# Altium schematic sheet Sensor.SchDoc
size A4
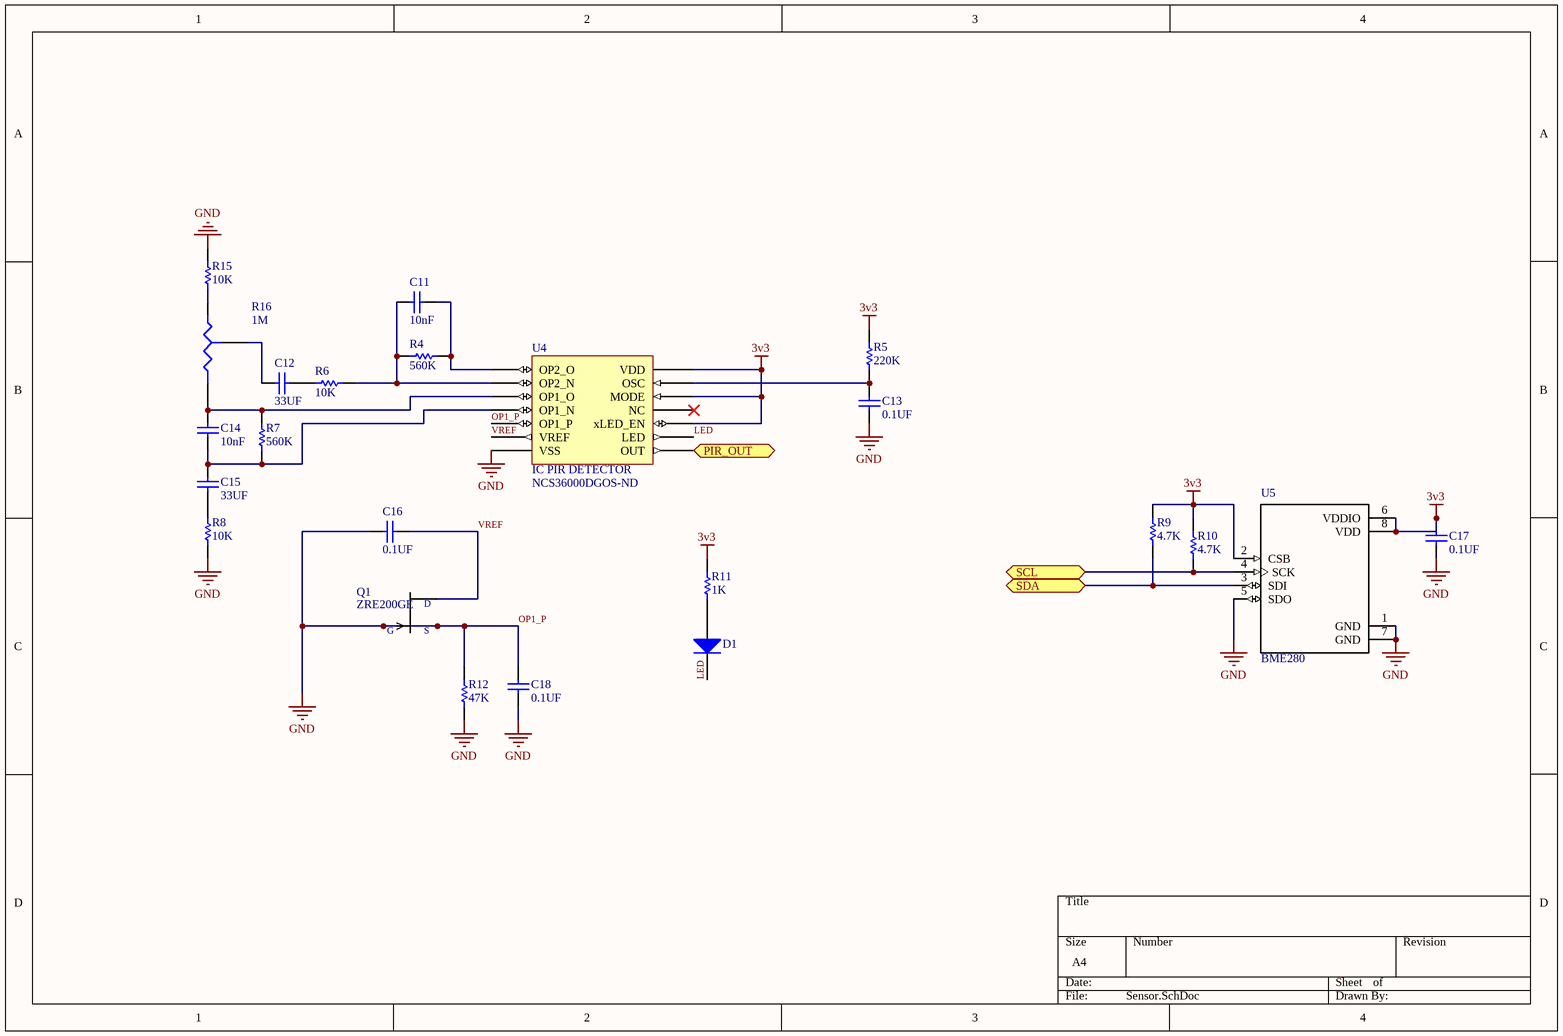
[diagram p0: Sensor.SchDoc]

## Parts
C11  10nF  [Chip2PinSM127P600-8N-SAMSUNG-0603]
C12  33UF  [Chip2PinSM127P600-8N-TDK_0603]
C13  0.1UF  [Chip2PinSM127P600-8N-SAMSUNG-0603]
C14  10nF  [Chip2PinSM127P600-8N-SAMSUNG-0603]
C15  33UF  [Chip2PinSM127P600-8N-TDK_0603]
C16  0.1UF  [Chip2PinSM127P600-8N-SAMSUNG-0603]
C17  0.1UF  [Chip2PinSM127P600-8N-SAMSUNG-0603]
C18  0.1UF  [Chip2PinSM127P600-8N-SAMSUNG-0603]
D1  SML-D12M8WT86  [LED_0603_ROHM]  (value not drawn)
Q1  ZRE200GE  [TO5]
R4  560K  [Chip2PinSM127P600-8N-Stackpole-0603]
R5  220K  [Chip2PinSM127P600-8N-vishay-0603]
R6  10K  [Chip2PinSM127P600-8N-vishay-0603]
R7  560K  [Chip2PinSM127P600-8N-Stackpole-0603]
R8  10K  [Chip2PinSM127P600-8N-vishay-0603]
R9  4.7K  [Chip2PinSM127P600-8N-vishay-0603]
R10  4.7K  [Chip2PinSM127P600-8N-vishay-0603]
R11  1K  [Chip2PinSM127P600-8N-vishay-0603]
R12  47K  [Chip2PinSM127P600-8N-0603-te]
R15  10K  [Chip2PinSM127P600-8N-vishay-0603]
R16  value 1M  [PCBComponent_1 - duplicate1]
U4  IC PIR DETECTOR  Supplier Part Number 1: NCS36000DGOS-ND  [SOIC127P600-8N-PIRIC_NCS36000]
U5  BME280  [PSON65P250X250X100-8N]

## Ports
PIR_OUT (out), SCL (bidir), SDA (bidir)

## Nets
3v3: C17.2 R5.2 R9.2 R10.2 R11.2 U4.10(xLED_EN) U4.12(MODE) U4.14(VDD) U5.2(CSB) U5.6(VDDIO) U5.8(VDD)
GND: C13.2 C16.1 C17.1 C18.2 Q1.3(G) R8.2 R12.1 R15.1 U4.7(VSS) U5.1(GND) U5.5(SDO) U5.7(GND)
LED: D1.2(K) U4.9(LED)
OP1_P: C18.1 Q1.2(S) R12.2 U4.5(OP1_P)
PIR_OUT: U4.8(OUT) ; port PIR_OUT
SCL: R10.1 U5.4(SCK) ; port SCL
SDA: R9.1 U5.3(SDI) ; port SDA
VREF: C16.2 Q1.1(D) U4.6(VREF)
NetC11_1: C11.1 R4.1 R6.2 U4.2(OP2_N)
NetC11_2: C11.2 R4.2 U4.1(OP2_O)
NetC12_1: C12.1 R16.3(TAP)
NetC12_2: C12.2 R6.1
NetC13_1: C13.1 R5.1 U4.13(OSC)
NetC14_1: C14.1 R7.2 R16.2(B) U4.3(OP1_O)
NetC14_2: C14.2 C15.2 R7.1 U4.4(OP1_N)
NetC15_1: C15.1 R8.1
NetD1_1: D1.1(A) R11.1
NetR15_2: R15.2 R16.1(A)

Not connected (* = marked no-connect by the designer): U4 11(NC)*

## Library data of the parts
C11 C14 = CL10B103KB8NCNC: CAP CER 10000PF 50V X7R 0603; Manufacturer: Samsung Electro-Mechanics; Tolerance: ±10%; Supplier 1: Digi-Key; Manufacturer Part Number: CL10B103KB8NCNC; RoHS: RoHS Compliant; Category: Capacitors; Stock 1: 1066876; Pricing 1: 1=0.09, 10=0.029, 100=0.0129, 500=0.00926, 1000=0.00728 (EUR); Packaging: Cut Tape (CT); Part Status: Active; Voltage - Rated: 50V; Temperature Coefficient: X7R; Operating Temperature: -55°C ~ 125°C; Features: -; Ratings: -; Applications: General Purpose; Mounting Type: Surface Mount, MLCC; Package / Case: 0603 (1608 Metric); Size / Dimension: 0.063" L x 0.031" W (1.60mm x 0.80mm); Height - Seated (Max): -; Thickness (Max): 0.035" (0.90mm); Lead Spacing: -; Lead Style: -; ComponentLink1URL: http://www.samsungsem.com/kr/support/product-search/mlcc/CL10B103KB8NCNC.jsp; ComponentLink1Description: http://www.samsungsem.com/kr/support/product-search/mlcc/CL10B103KB8NCNC.jsp; Supplier Part Number 1: 1276-1921-1-ND
C12 C15 = C2012X5R0J336M125AC: CAP CER 33UF 6.3V X5R 0805; Manufacturer: TDK Corporation; Tolerance: ±20%; Notification: Current market demand for these product types have resulted in fluctuating and extending lead times. Lead times may differ.; Supplier 1: Digi-Key; Manufacturer Part Number: C2012X5R0J336M125AC; RoHS: RoHS Compliant; Category: Capacitors; Stock 1: 20000; Pricing 1: 1=0.86, 10=0.654, 100=0.4676, 500=0.362, 1000=0.31172 (EUR); Packaging: Digi-Reel®; Part Status: Active; Voltage - Rated: 6.3V; Temperature Coefficient: X5R; Operating Temperature: -55°C ~ 85°C; Features: Low ESL; Ratings: -; Applications: General Purpose; Failure Rate: -; Mounting Type: Surface Mount, MLCC; Package / Case: 0805 (2012 Metric); Size / Dimension: 0.079" L x 0.049" W (2.00mm x 1.25mm); Height - Seated (Max): -; Thickness (Max): 0.057" (1.45mm); Lead Spacing: -; Lead Style: -; ComponentLink1URL: https://product.tdk.com/info/en/catalog/datasheets/mlcc_commercial_general_en.pdf; ComponentLink1Description: https://product.tdk.com/info/en/catalog/datasheets/mlcc_commercial_general_en.pdf; Supplier Part Number 1: 445-5986-6-ND
C13 C16-C18 = CL10F104ZO8NNNC: CAP CER 0.1UF 16V Y5V 0603; Manufacturer: Samsung Electro-Mechanics; Tolerance: -20%, +80%; Temperature Coefficient: Y5V (F); Notification: Current market demand for these product types have resulted in fluctuating and extending lead times. Lead times may differ.; Supplier 1: Digi-Key; Manufacturer Part Number: CL10F104ZO8NNNC; RoHS: RoHS Compliant; Category: Capacitors; Stock 1: 40000; Pricing 1: 1=0.08, 10=0.032, 100=0.0144, 500=0.01026, 1000=0.00806 (EUR); Packaging: Cut Tape (CT); Part Status: Active; Voltage - Rated: 16V; Operating Temperature: -30°C ~ 85°C; Features: -; Ratings: -; Applications: General Purpose; Mounting Type: Surface Mount, MLCC; Package / Case: 0603 (1608 Metric); Size / Dimension: 0.063" L x 0.031" W (1.60mm x 0.80mm); Height - Seated (Max): -; Thickness (Max): 0.035" (0.90mm); Lead Spacing: -; Lead Style: -; ComponentLink1URL: http://www.samsungsem.com/kr/support/product-search/mlcc/CL10F104ZO8NNNC.jsp; ComponentLink1Description: http://www.samsungsem.com/kr/support/product-search/mlcc/CL10F104ZO8NNNC.jsp; Supplier Part Number 1: 1276-1258-1-ND
D1 = SML-D12M8WT86: LED GREEN DIFFUSED 0603 SMD; Manufacturer: Rohm Semiconductor; Configuration: Standard; Lens Color: White; Millicandela Rating: 25mcd; Lens Style: Rectangle with Flat Top; Lens Size: 1.20mm x 0.80mm; Voltage - Forward (Vf) (Typ): 2.2V; Current - Test: 20mA; Wavelength - Dominant: 572nm; Supplier 1: Digi-Key; Manufacturer Part Number: SML-D12M8WT86; RoHS: RoHS Compliant; Category: Optoelectronics; Stock 1: 315568; Pricing 1: 1=0.3, 10=0.219, 25=0.1616, 100=0.1154, 250=0.07848, 500=0.06926, 1000=0.05425 (EUR); Packaging: Cut Tape (CT); Part Status: Active; Color: Green; Lens Transparency: Diffused; Viewing Angle: -; Mounting Type: Surface Mount; Wavelength - Peak: -; Features: -; Package / Case: 0603 (1608 Metric); Supplier Device Package: 0603 (1608 Metric); Size / Dimension: 1.60mm L x 0.80mm W; Height (Max): 0.65mm; Base Part Number: SML-D12; ComponentLink1URL: https://www.rohm.com/datasheet/SML-D12V8W; ComponentLink1Description: https://www.rohm.com/datasheet/SML-D12V8W
Q1 = ZRE200GE: Zmotion Pir Sensor Dual Element; MF: Zilog; MP: ZRE200GE; SnapEDA_Link: https://www.snapeda.com/parts/ZRE200GE/Zilog/view-part/?ref=snap; Digi-Key_Part_Number: 269-4955-ND; Digi-Key_Purchase_URL: https://www.digikey.com/product-detail/en/zilog/ZRE200GE/269-4955-ND/5147335?utm_source=snapeda&utm_medium=aggregator&utm_campaign=symbol; Package: TO-5-3 Zilog; Value: *
R4 R7 = ERJ-3EKF5603V: RES SMD 560K OHM 1% 1/10W 0603; Manufacturer: Panasonic Electronic Components; Power (Watts): 0.1W, 1/10W; Temperature Coefficient: ±100ppm/°C; Supplier 1: Digi-Key; Manufacturer Part Number: ERJ-3EKF5603V; RoHS: RoHS Compliant; Category: Resistors; Stock 1: 221508; Pricing 1: 1=0.09, 10=0.057, 100=0.0231, 1000=0.01037, 2500=0.009 (EUR); Packaging: Cut Tape (CT); Part Status: Active; Tolerance: ±1%; Composition: Thick Film; Features: Automotive AEC-Q200; Operating Temperature: -55°C ~ 155°C; Package / Case: 0603 (1608 Metric); Supplier Device Package: 0603; Size / Dimension: 0.063" L x 0.032" W (1.60mm x 0.80mm); Height - Seated (Max): 0.022" (0.55mm); Failure Rate: -; ComponentLink1URL: https://industrial.panasonic.com/cdbs/www-data/pdf/RDA0000/AOA0000C304.pdf; ComponentLink1Description: https://industrial.panasonic.com/cdbs/www-data/pdf/RDA0000/AOA0000C304.pdf; Supplier Part Number 1: P560KHCT-ND
R5 = CRCW0603220KFKEAC: RES SMD 220K OHM 1% 1/10W 0603; Manufacturer: Vishay Dale; Power (Watts): 0.1W, 1/10W; Temperature Coefficient: ±100ppm/°C; Supplier 1: Digi-Key; Manufacturer Part Number: CRCW0603220KFKEAC; RoHS: RoHS Compliant; Category: Resistors; Stock 1: 154470; Pricing 1: 1=0.09, 10=0.026, 100=0.0108, 1000=0.00484, 2500=0.0042 (EUR); Packaging: Cut Tape (CT); Part Status: Active; Tolerance: ±1%; Composition: Thick Film; Features: -; Operating Temperature: -55°C ~ 155°C; Package / Case: 0603 (1608 Metric); Supplier Device Package: 0603; Height - Seated (Max): 0.022" (0.55mm); Failure Rate: -; ComponentLink1URL: http://www.vishay.com/docs/28773/crcwce3.pdf; ComponentLink1Description: http://www.vishay.com/docs/28773/crcwce3.pdf; Supplier Part Number 1: 541-4039-1-ND
R6 R8 R15 = MCT06030C1002FP500: RES SMD 10K OHM 1% 1/8W 0603; Manufacturer: Vishay Beyschlag; Power (Watts): 0.125W, 1/8W; Temperature Coefficient: ±50ppm/°C; Supplier 1: Digi-Key; Manufacturer Part Number: MCT06030C1002FP500; RoHS: RoHS Compliant; Category: Resistors; Stock 1: 1201929; Pricing 1: 1=0.16, 10=0.133, 100=0.0521, 1000=0.02182, 2500=0.02 (EUR); Packaging: Cut Tape (CT); Part Status: Active; Tolerance: ±1%; Composition: Thin Film; Features: Anti-Sulfur; Operating Temperature: -55°C ~ 155°C; Package / Case: 0603 (1608 Metric); Supplier Device Package: 0603; Size / Dimension: 0.061" L x 0.033" W (1.55mm x 0.85mm); Height - Seated (Max): 0.022" (0.55mm); Failure Rate: -; ComponentLink1URL: http://www.vishay.com/docs/28705/mcx0x0xpro.pdf; ComponentLink1Description: http://www.vishay.com/docs/28705/mcx0x0xpro.pdf; Supplier Part Number 1: MCT0603-10.0K-CFCT-ND
R9 R10 = CRCW06034K70JNEAC: RES SMD 4.7K OHM 5% 1/10W 0603; Manufacturer: Vishay Dale; Power (Watts): 0.1W, 1/10W; Temperature Coefficient: ±200ppm/°C; Supplier 1: Digi-Key; Manufacturer Part Number: CRCW06034K70JNEAC; RoHS: RoHS Compliant; Category: Resistors; Stock 1: 819006; Pricing 1: 1=0.09, 10=0.019, 100=0.008, 1000=0.00357, 2500=0.0031 (EUR); Packaging: Digi-Reel®; Part Status: Active; Tolerance: ±5%; Composition: Thick Film; Features: -; Operating Temperature: -55°C ~ 155°C; Package / Case: 0603 (1608 Metric); Supplier Device Package: 0603; Height - Seated (Max): 0.022" (0.55mm); Failure Rate: -; ComponentLink1URL: http://www.vishay.com/docs/28773/crcwce3.pdf; ComponentLink1Description: http://www.vishay.com/docs/28773/crcwce3.pdf; Supplier Part Number 1: 541-3993-6-ND
R11 = MCT06030C1001FP500: RES SMD 1K OHM 1% 1/8W 0603; Manufacturer: Vishay Beyschlag; Power (Watts): 0.125W, 1/8W; Temperature Coefficient: ±50ppm/°C; Supplier 1: Digi-Key; Manufacturer Part Number: MCT06030C1001FP500; RoHS: RoHS Compliant; Category: Resistors; Stock 1: 193422; Pricing 1: 1=0.16, 10=0.133, 100=0.0521, 1000=0.02182, 2500=0.02 (EUR); Packaging: Cut Tape (CT); Part Status: Active; Tolerance: ±1%; Composition: Thin Film; Features: Anti-Sulfur; Operating Temperature: -55°C ~ 155°C; Package / Case: 0603 (1608 Metric); Supplier Device Package: 0603; Size / Dimension: 0.061" L x 0.033" W (1.55mm x 0.85mm); Height - Seated (Max): 0.022" (0.55mm); Failure Rate: -; ComponentLink1URL: http://www.vishay.com/docs/28705/mcx0x0xpro.pdf; ComponentLink1Description: http://www.vishay.com/docs/28705/mcx0x0xpro.pdf; Supplier Part Number 1: MCT0603-1.00K-CFCT-ND
R12 = CRGCQ0603F47K: CRGCQ 0603 47K 1%; Manufacturer: TE Connectivity Passive Product; Power (Watts): 0.1W, 1/10W; Temperature Coefficient: ±100ppm/°C; Supplier 1: Digi-Key; Manufacturer Part Number: CRGCQ0603F47K; RoHS: RoHS Compliant; Category: Resistors; Stock 1: 50; Pricing 1: 1=0.09, 10=0.026, 100=0.0106, 1000=0.00474, 2500=0.00411 (EUR); Packaging: Cut Tape (CT); Part Status: Active; Tolerance: ±1%; Composition: Thick Film; Features: Automotive AEC-Q200, Moisture Resistant; Operating Temperature: -55°C ~ 155°C; Package / Case: 0603 (1608 Metric); Supplier Device Package: 0603; Size / Dimension: 0.063" L x 0.031" W (1.60mm x 0.80mm); Height - Seated (Max): 0.022" (0.55mm); Failure Rate: -; ComponentLink1URL: https://www.te.com/commerce/DocumentDelivery/DDEController?Action=srchrtrv&DocNm=1773204-3&DocType=DS&DocLang=English; ComponentLink1Description: https://www.te.com/commerce/DocumentDelivery/DDEController?Action=srchrtrv&DocNm=1773204-3&DocType=DS&DocLang=English; Supplier Part Number 1: A129708CT-ND
R16 = Res Tap: Tapped Resistor; Manufacturer: Bourns Inc.; Manufacturer Part Number: TC33X-2-105E; Sim Note: Enter the Resistance value and the set point into parameter fields.; Set Position: 0.5; Power (Watts): 0.1W, 1/10W; Tolerance: ±25%; Temperature Coefficient: ±250ppm/°C; Adjustment Type: Top Adjustment; Resistive Material: Cermet; Published: 24-Mar-1999; LatestRevisionDate: 17-Jul-2002; LatestRevisionNote: Re-released for DXP Platform.; PackageReference: VR3; Publisher: Altium Limited; PackageDescription: Variable Resistor, Thru-Hole; 3 Leads; Supplier 1: Digi-Key; Supplier Part Number 1: TC33X-2-105ECT-ND; RoHS: RoHS Compliant; Category: Potentiometers, Variable Resistors; Stock 1: 32075; Pricing 1: 1=0.24, 10=0.242, 25=0.2188, 50=0.2088, 100=0.202, 250=0.18852, 500=0.1717, 1000=0.15486 (EUR); Packaging: Cut Tape (CT); Part Status: Active; Mounting Type: Surface Mount; Termination Style: J Lead; Size / Dimension: Rectangular - 0.150" x 0.142" Face x 0.047" H (3.80mm x 3.60mm x 1.20mm); ComponentLink1URL: https://www.bourns.com/docs/Product-Datasheets/TC33.pdf; ComponentLink1Description: https://www.bourns.com/docs/Product-Datasheets/TC33.pdf
U4 = NCS36000DG: IC PIR DETECTOR CTLR 14SOIC; Manufacturer: ON Semiconductor; Input Type: Digital; Interface: CMOS; Supplier 1: Digi-Key; Manufacturer Part Number: NCS36000DG; RoHS: RoHS Compliant; Category: Integrated Circuits (ICs); Stock 1: 566; Pricing 1: 1=0.75, 55=0.63655, 110=0.52291, 550=0.43195, 1045=0.34101 (EUR); Packaging: Tray; Part Status: Active; Type: Detector Controller; Output Type: Digital; Operating Temperature: -40°C ~ 85°C; Mounting Type: Surface Mount; Package / Case: 14-SOIC (0.154", 3.90mm Width); Supplier Device Package: 14-SOIC; Base Part Number: NCS36000; ComponentLink1URL: http://www.onsemi.com/pub/Collateral/NCS36000-D.PDF; ComponentLink1Description: http://www.onsemi.com/pub/Collateral/NCS36000-D.PDF
U5 = BME280: Integrated pressure, humidity and temperature sensor; 8-pin 2.5x2.5x0.93mm LGA; MF: Bosch; MP: BME280; SnapEDA_Link: https://www.snapeda.com/parts/BME280/Bosch%20Sensortec/view-part/?ref=snap; Digi-Key_Part_Number: 828-1063-1-ND; Digi-Key_Purchase_URL: https://www.digikey.es/product-detail/en/bosch-sensortec/BME280/828-1063-1-ND/6136314?utm_source=snapeda&utm_medium=aggregator&utm_campaign=symbol; Package: LGA-8 Bosch; Value: *